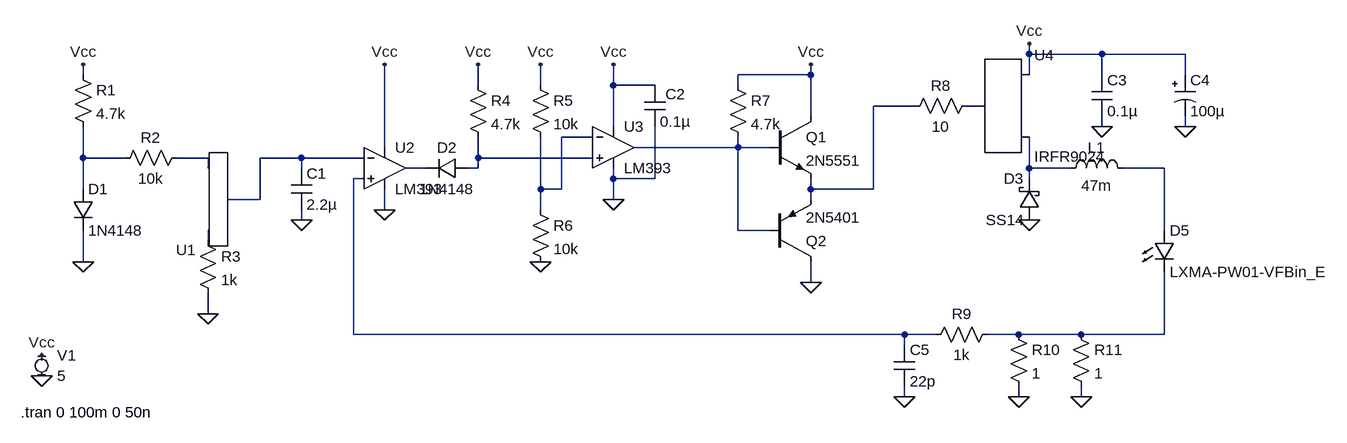
[diagram p0: schematic Kursach.asc]
Kursach.asc, the LTspice schematic file:
Version 4
SHEET 1 2068 680
WIRE 1600 64 1600 48
WIRE 1712 64 1600 64
WIRE 1840 64 1712 64
WIRE 144 96 144 80
WIRE 1264 96 1264 80
WIRE 1264 96 1152 96
WIRE 1600 96 1600 64
WIRE 1712 96 1712 64
WIRE 1840 96 1840 64
WIRE 752 112 752 80
WIRE 848 112 848 80
WIRE 960 112 960 80
WIRE 1024 112 960 112
WIRE 1152 112 1152 96
WIRE 1424 144 1360 144
WIRE 1520 144 1504 144
WIRE 1264 160 1264 96
WIRE 960 176 960 112
WIRE 1712 176 1712 160
WIRE 1840 176 1840 160
WIRE 928 192 880 192
WIRE 608 208 608 80
WIRE 1152 208 1152 192
WIRE 1152 208 992 208
WIRE 1200 208 1152 208
WIRE 144 224 144 176
WIRE 208 224 144 224
WIRE 336 224 288 224
WIRE 480 224 416 224
WIRE 576 224 480 224
WIRE 752 224 752 192
WIRE 928 224 752 224
WIRE 336 240 336 224
WIRE 480 240 480 224
WIRE 672 240 640 240
WIRE 752 240 752 224
WIRE 752 240 736 240
WIRE 1600 240 1600 192
WIRE 1664 240 1600 240
WIRE 1808 240 1744 240
WIRE 576 256 560 256
WIRE 960 256 960 240
WIRE 1024 256 1024 176
WIRE 1024 256 960 256
WIRE 1600 256 1600 240
WIRE 144 272 144 224
WIRE 848 272 848 192
WIRE 880 272 880 192
WIRE 880 272 848 272
WIRE 1264 272 1264 256
WIRE 1360 272 1360 144
WIRE 1360 272 1264 272
WIRE 416 288 416 224
WIRE 416 288 368 288
WIRE 960 288 960 256
WIRE 1264 288 1264 272
WIRE 608 304 608 272
WIRE 848 304 848 272
WIRE 480 320 480 304
WIRE 1152 336 1152 208
WIRE 1200 336 1152 336
WIRE 1808 336 1808 240
WIRE 336 352 336 336
WIRE 144 384 144 336
WIRE 1264 416 1264 384
WIRE 336 464 336 432
WIRE 560 496 560 256
WIRE 1408 496 560 496
WIRE 1456 496 1408 496
WIRE 1584 496 1536 496
WIRE 1680 496 1584 496
WIRE 1808 496 1808 400
WIRE 1808 496 1680 496
WIRE 1408 512 1408 496
WIRE 1408 592 1408 576
WIRE 1584 592 1584 576
WIRE 1680 592 1680 576
FLAG 144 384 0
FLAG 1712 176 0
FLAG 1840 176 0
FLAG 1408 592 0
FLAG 1584 592 0
FLAG 1680 592 0
FLAG 336 464 0
FLAG 480 320 0
FLAG 848 384 0
FLAG 960 288 0
FLAG 1264 416 0
FLAG 1600 320 0
FLAG 608 304 0
FLAG 80 560 0
FLAG 80 528 Vcc
FLAG 144 80 Vcc
FLAG 608 80 Vcc
FLAG 752 80 Vcc
FLAG 848 80 Vcc
FLAG 960 80 Vcc
FLAG 1264 80 Vcc
FLAG 1600 48 Vcc
SYMBOL res 128 80 R0
SYMATTR InstName R1
SYMATTR Value 4.7k
SYMBOL diode 128 272 R0
SYMATTR InstName D1
SYMATTR Value 1N4148
SYMBOL res 304 208 R90
WINDOW 0 0 56 VBottom 2
WINDOW 3 32 56 VTop 2
SYMATTR InstName R2
SYMATTR Value 10k
SYMBOL EXTRA\\Misc\\pot 336 288 R180
SYMATTR InstName U1
SYMATTR Value2 T=0.6
SYMBOL res 320 336 R0
SYMATTR InstName R3
SYMATTR Value 1k
SYMBOL cap 464 240 R0
SYMATTR InstName C1
SYMATTR Value 2.2µ
SYMBOL SBORKA\\COMPARATOR\\lm393 608 240 R0
SYMATTR InstName U2
SYMBOL diode 736 224 R90
WINDOW 0 0 32 VBottom 2
WINDOW 3 32 32 VTop 2
SYMATTR InstName D2
SYMATTR Value 1N4148
SYMBOL res 736 96 R0
SYMATTR InstName R4
SYMATTR Value 4.7k
SYMBOL res 832 288 R0
SYMATTR InstName R6
SYMATTR Value 10k
SYMBOL res 832 96 R0
SYMATTR InstName R5
SYMATTR Value 10k
SYMBOL SBORKA\\COMPARATOR\\lm393 960 208 R0
SYMATTR InstName U3
SYMBOL cap 1008 112 R0
WINDOW 0 32 14 Left 2
SYMATTR InstName C2
SYMATTR Value 0.1µ
SYMBOL res 1136 96 R0
SYMATTR InstName R7
SYMATTR Value 4.7k
SYMBOL npn 1200 160 R0
SYMATTR InstName Q1
SYMATTR Value 2N5551
SYMBOL pnp 1200 384 M180
SYMATTR InstName Q2
SYMATTR Value 2N5401
SYMBOL res 1520 128 R90
WINDOW 0 0 56 VBottom 2
WINDOW 3 32 56 VTop 2
SYMATTR InstName R8
SYMATTR Value 10
SYMBOL EXTRA\\IRF\\PMOSFET\\irfr9024 1600 144 R0
SYMATTR InstName U4
SYMBOL cap 1696 96 R0
SYMATTR InstName C3
SYMATTR Value 0.1µ
SYMBOL ind 1648 256 R270
WINDOW 0 32 56 VTop 2
WINDOW 3 5 56 VBottom 2
SYMATTR InstName L1
SYMATTR Value 47m
SYMBOL schottky 1616 320 R180
WINDOW 0 24 64 Left 2
WINDOW 3 24 0 Left 2
SYMATTR InstName D3
SYMATTR Value SS14
SYMBOL res 1552 480 R90
WINDOW 0 0 56 VBottom 2
WINDOW 3 32 56 VTop 2
SYMATTR InstName R9
SYMATTR Value 1k
SYMBOL cap 1392 512 R0
SYMATTR InstName C5
SYMATTR Value 22p
SYMBOL res 1568 480 R0
SYMATTR InstName R10
SYMATTR Value 1
SYMBOL res 1664 480 R0
SYMATTR InstName R11
SYMATTR Value 1
SYMBOL MiniSyms4\\voltage- 80 544 R0
WINDOW 123 0 0 Left 0
WINDOW 39 0 0 Left 0
SYMATTR InstName V1
SYMATTR Value 5
SYMBOL polcap 1824 96 R0
SYMATTR InstName C4
SYMATTR Value 100µ
SYMBOL LED 1792 336 R0
SYMATTR InstName D5
SYMATTR Value LXMA-PW01-VFBin_E
TEXT 48 616 Left 2 !.tran 0 100m 0 50n

The netlist it stands for:
* Kursach.asc
R1 Vcc N005 4.7k
D1 N005 0 1N4148
R2 N006 N005 10k
XU1 N013 N006 N007 T=0.6
R3 N013 0 1k
C1 N007 0 2.2µ
XU2 N012 N007 Vcc 0 N009 LM393  ; pins In+ In- V+ V- OUT
D2 N008 N009 1N4148
R4 Vcc N008 4.7k
R6 N003 0 10k
R5 Vcc N003 10k
XU3 N008 N003 Vcc 0 N004 LM393  ; pins In+ In- V+ V- OUT
C2 Vcc 0 0.1µ
R7 Vcc N004 4.7k
Q1 Vcc N004 N001 0 2N5551
Q2 0 N004 N001 0 2N5401
R8 N002 N001 10
XU4 N010 N002 Vcc IRFR9024
C3 Vcc 0 0.1µ
L1 N010 N011 47m
D3 0 N010 SS14
R9 N014 N012 1k
C5 N012 0 22p
R10 N014 0 1
R11 N014 0 1
V1 Vcc 0 5
C4 Vcc 0 100µ
D5 N011 N014 LXMA-PW01-VFBin_E
.model D D
.lib standard.dio
.model NPN NPN
.model PNP PNP
.lib standard.bjt
.tran 0 100m 0 50n
.lib POT.lib
.lib IRFR9024.spi
.backanno
.end